# Altium schematic sheet Power.SchDoc
size A4 portrait
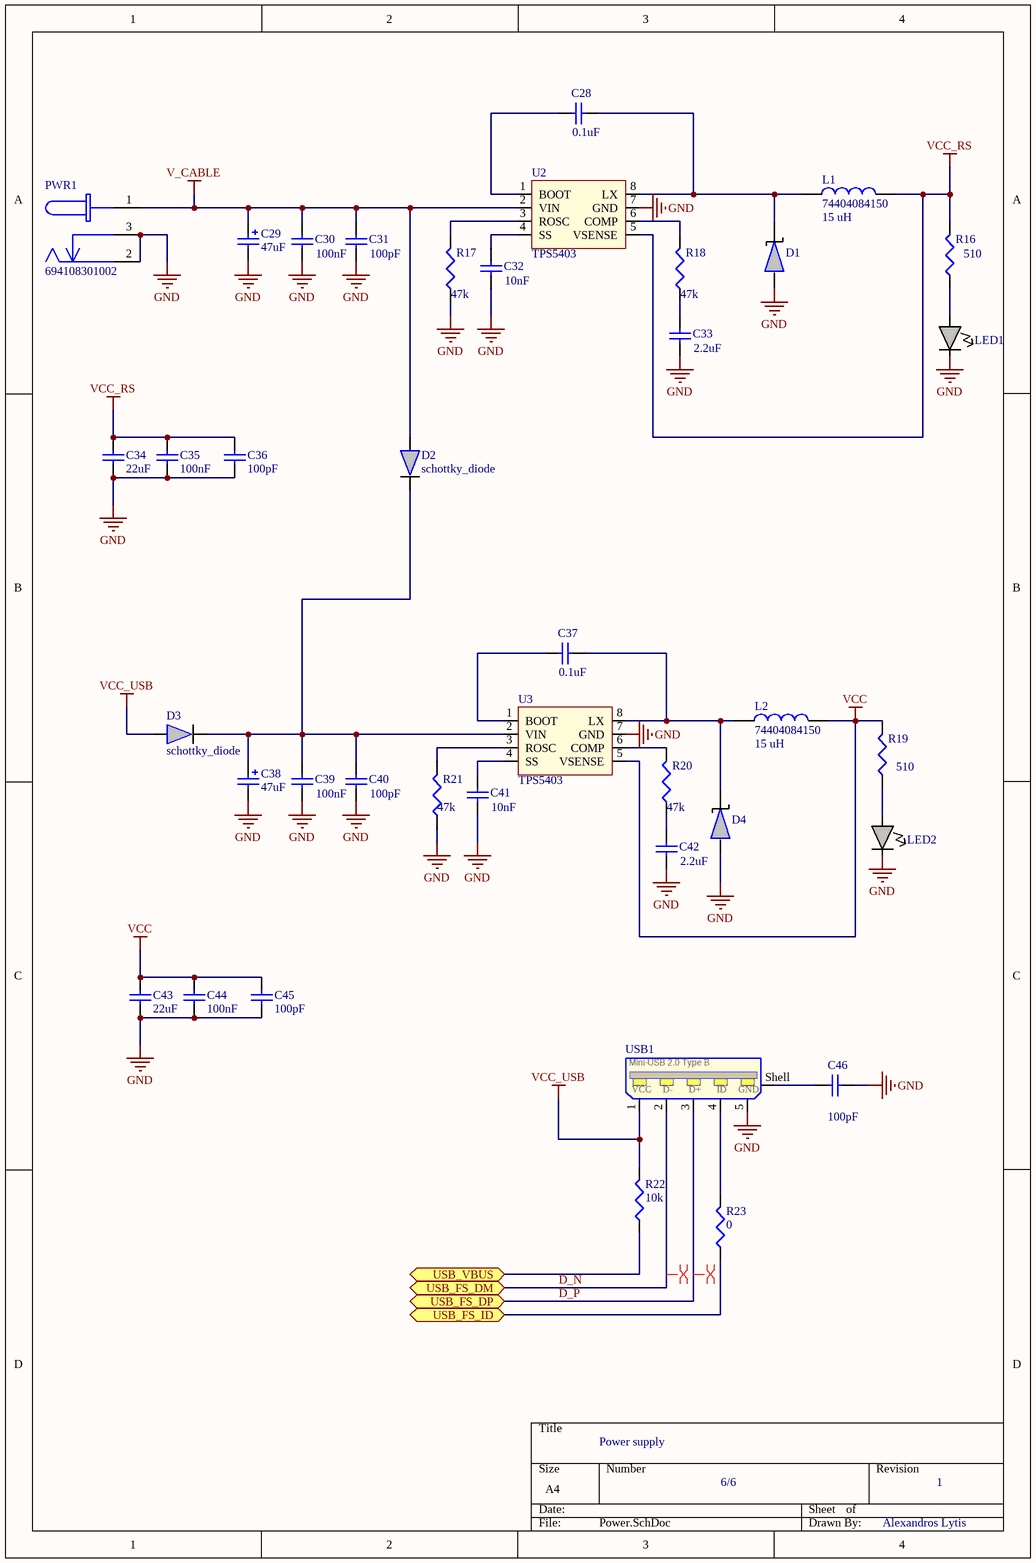
[diagram p0: Power.SchDoc]

## Parts
C28  value 0.1uF  [CAP0603]  (hidden comment: Cap Semi)
C29  47uF  [WCAP-ASLI_6.3x7.7]
C30  value 100nF  [CAP0603]  (hidden comment: Cap Semi)
C31  value 100pF  [CAP0603]  (hidden comment: Cap Semi)
C32  value 10nF  [CAP0603]  (hidden comment: Cap Semi)
C33  value 2.2uF  [CAP0603]  (hidden comment: Cap Semi)
C34  22uF  [WCAP-ASNP_6.3x5.5]
C35  value 100nF  [CAP0603]  (hidden comment: Cap Semi)
C36  value 100pF  [CAP0603]  (hidden comment: Cap Semi)
C37  value 0.1uF  [CAP0603]  (hidden comment: Cap Semi)
C38  47uF  [WCAP-ASLI_6.3x7.7]
C39  value 100nF  [CAP0603]  (hidden comment: Cap Semi)
C40  value 100pF  [CAP0603]  (hidden comment: Cap Semi)
C41  value 10nF  [CAP0603]  (hidden comment: Cap Semi)
C42  value 2.2uF  [CAP0603]  (hidden comment: Cap Semi)
C43  22uF  [WCAP-ASNP_6.3x5.5]
C44  value 100nF  [CAP0603]  (hidden comment: Cap Semi)
C45  value 100pF  [CAP0603]  (hidden comment: Cap Semi)
C46  value 100pF  [CAP0603]  (hidden comment: Cap Semi)
D1  schottky Diode  [DIOM1709X08N]  (value not drawn)
D2  schottky_diode  [MBR180S1]
D3  schottky_diode  [MBR180S1]
D4  schottky Diode  [DIOM1709X08N]  (value not drawn)
L1  74404084150  value 15 uH  [WE-LQS_8040]
L2  74404084150  value 15 uH  [WE-LQS_8040]
LED1  LED_1.6x0.8mm  [1608[0603]]  (value not drawn)
LED2  LED_1.6x0.8mm  [1608[0603]]  (value not drawn)
PWR1  694108301002  [694108301002]
R16  value 510  [RES0603]  (hidden comment: Res3)
R17  value 47k  [RES0603]  (hidden comment: Res3)
R18  value 47k  [RES0603]  (hidden comment: Res3)
R19  value 510  [RES0603]  (hidden comment: Res3)
R20  value 47k  [RES0603]  (hidden comment: Res3)
R21  value 47k  [RES0603]  (hidden comment: Res3)
R22  value 10k  [RES0603]  (hidden comment: Res3)
R23  value 0  [RES0603]  (hidden comment: Res3)
U2  TPS5403  [SOIC127P600X175-8M]
U3  TPS5403  [SOIC127P600X175-8M]
USB1  65100516121  [65100516121]  (value not drawn)

## Ports
USB_FS_DM, USB_FS_DP, USB_FS_ID, USB_VBUS

## Nets
GND: C29.2(N) C30.1 C31.1 C32.1 C33.1 C34.1 C35.1 C36.1 C38.2(N) C39.1 C40.1 C41.1 C42.1 C43.1 C44.1 C45.1 C46.2 D1.2(anode) D4.2(anode) LED1.2 LED2.2 PWR1.2 PWR1.3 R17.1 R21.1 U2.7(GND) U3.7(GND) USB1.5(GND)
V_CABLE: C29.1(P) C30.2 C31.2 D2.2(Anode) PWR1.1 U2.2(VIN)
VCC: C43.2 C44.2 C45.2 L2.2 R19.2 U3.5(VSENSE)
VCC_RS: C34.2 C35.2 C36.2 L1.2 R16.2 U2.5(VSENSE)
VCC_USB: D3.2(Anode) R22.2 USB1.1(VCC)
D_N: USB1.2(D-) ; port USB_FS_DM
D_P: USB1.3(D+) ; port USB_FS_DP
USB_FS_ID: R23.1 ; port USB_FS_ID
USB_VBUS: R22.1 ; port USB_VBUS
NetC28_1: C28.1 D1.1(Cathode) L1.1 U2.8(LX)
NetC28_2: C28.2 U2.1(BOOT)
NetC32_2: C32.2 U2.4(SS)
NetC33_2: C33.2 R18.1
NetC37_1: C37.1 D4.1(Cathode) L2.1 U3.8(LX)
NetC37_2: C37.2 U3.1(BOOT)
NetC38_1: C38.1(P) C39.2 C40.2 D2.1(Cathode) D3.1(Cathode) U3.2(VIN)
NetC41_2: C41.2 U3.4(SS)
NetC42_2: C42.2 R20.1
NetC46_1: C46.1 USB1.Shell
NetLED1_1: LED1.1 R16.1
NetLED2_1: LED2.1 R19.1
NetR17_2: R17.2 U2.3(ROSC)
NetR18_2: R18.2 U2.6(COMP)
NetR20_2: R20.2 U3.6(COMP)
NetR21_2: R21.2 U3.3(ROSC)
NetR23_2: R23.2 USB1.4(ID)

## Layout directives
differential pair: D_N, D_P

## Notes on the sheet
- Power supply
- 6/6
- 1
- Alexandros Lytis
- (in symbol 65100516121) Mini-USB 2.0 Type B

## Library data of the parts
C28 C30-C33 C35-C37 C39-C42 C44-C46 = Cap Semi: Capacitor (Semiconductor SIM Model); Published: 8-Jun-2000; LatestRevisionDate: 29-May-2009; LatestRevisionNote: IPC-7351 Footprint Added.; PackageReference: C1206; Publisher: Altium Limited; PackageDescription: Chip Capacitor
C29 C38 = WCAP-ASLI, 865080645012: WCAP-ASLI Aluminum Electrolytic Capacitors, 47uF; RatedVoltage: 50V; PublishedDate: July 2016; Publisher: Wurth Elektronik; ComponentLink1Description: Manufacturer; ComponentLink1URL: http://www.we-online.de; ComponentLink2Description: Datasheet; ComponentLink2URL: http://katalog.we-online.com/pbs/datasheet/865080645012.pdf; PartNumber: 865080645012; Value: 47uF; Size: 6.3mmx7.7mm
C34 C43 = WCAP-ASNP, 865250543005: WCAP-ASNP Aluminum Electrolytic Capacitors, 22uF; RatedVoltage: 35V; PublishedDate: July 2016; Publisher: Wurth Elektronik; ComponentLink1Description: Manufacturer; ComponentLink1URL: http://www.we-online.de; ComponentLink2Description: Datasheet; ComponentLink2URL: http://katalog.we-online.com/pbs/datasheet/865250543005.pdf; PartNumber: 865250543005; Value: 22uF; Size: 6.3mmx5.5mm
D1 D4 = SMD_schottky_CDBU0130L
D2 D3 = MRB180S1 schottky
L1 L2 = 74404084150: WE-LQS SMD Power Inductor, size 8040, 15 uH; RatedCurrent: 2.6 A; PublishedDate: Nov. 2016; Publisher: Wurth Elektronik; ComponentLink1Description: Manufacturer; ComponentLink1URL: http://www.we-online.de; ComponentLink2Description: Datasheet; ComponentLink2URL: http://katalog.we-online.de/pbs/datasheet/74404084150.pdf; PartNumber: 74404084150; Size: 8040
PWR1 = 694108301002: WR-DC DC Power Jack Right Angled(6.4); Published: June 2016; Publisher: Wurth Elektronik; ComponentLink1Description: Manufacturer; ComponentLink1URL: http://www.we-online.de; ComponentLink2Description: Datasheet; ComponentLink2URL: http://katalog.we-online.de/em/datasheet/6941xx301002.pdf; PartNumber: 694108301002
R16-R23 = Res3: Resistor; Published: 8-Jun-2000; LatestRevisionDate: 29-May-2009; LatestRevisionNote: IPC-7351 Footprint Added.; PackageReference: J1-0603; Publisher: Altium Limited; PackageDescription: Chip Resistor
U2 U3 = TPS5403: switching power-3.3V
USB1 = 65100516121: WR-COM Mini USB 2.0 Type B SMT Horizontal 5 Contacts; Published: June 2016; Publisher: Wurth Elektronik; ComponentLink1Description: Manufacturer; ComponentLink1URL: http://www.we-online.de; ComponentLink2Description: Datasheet; ComponentLink2URL: http://katalog.we-online.de/em/datasheet/65100516121.pdf; PartNumber: 65100516121